# Altium project YAPCBBC.PrjPcb
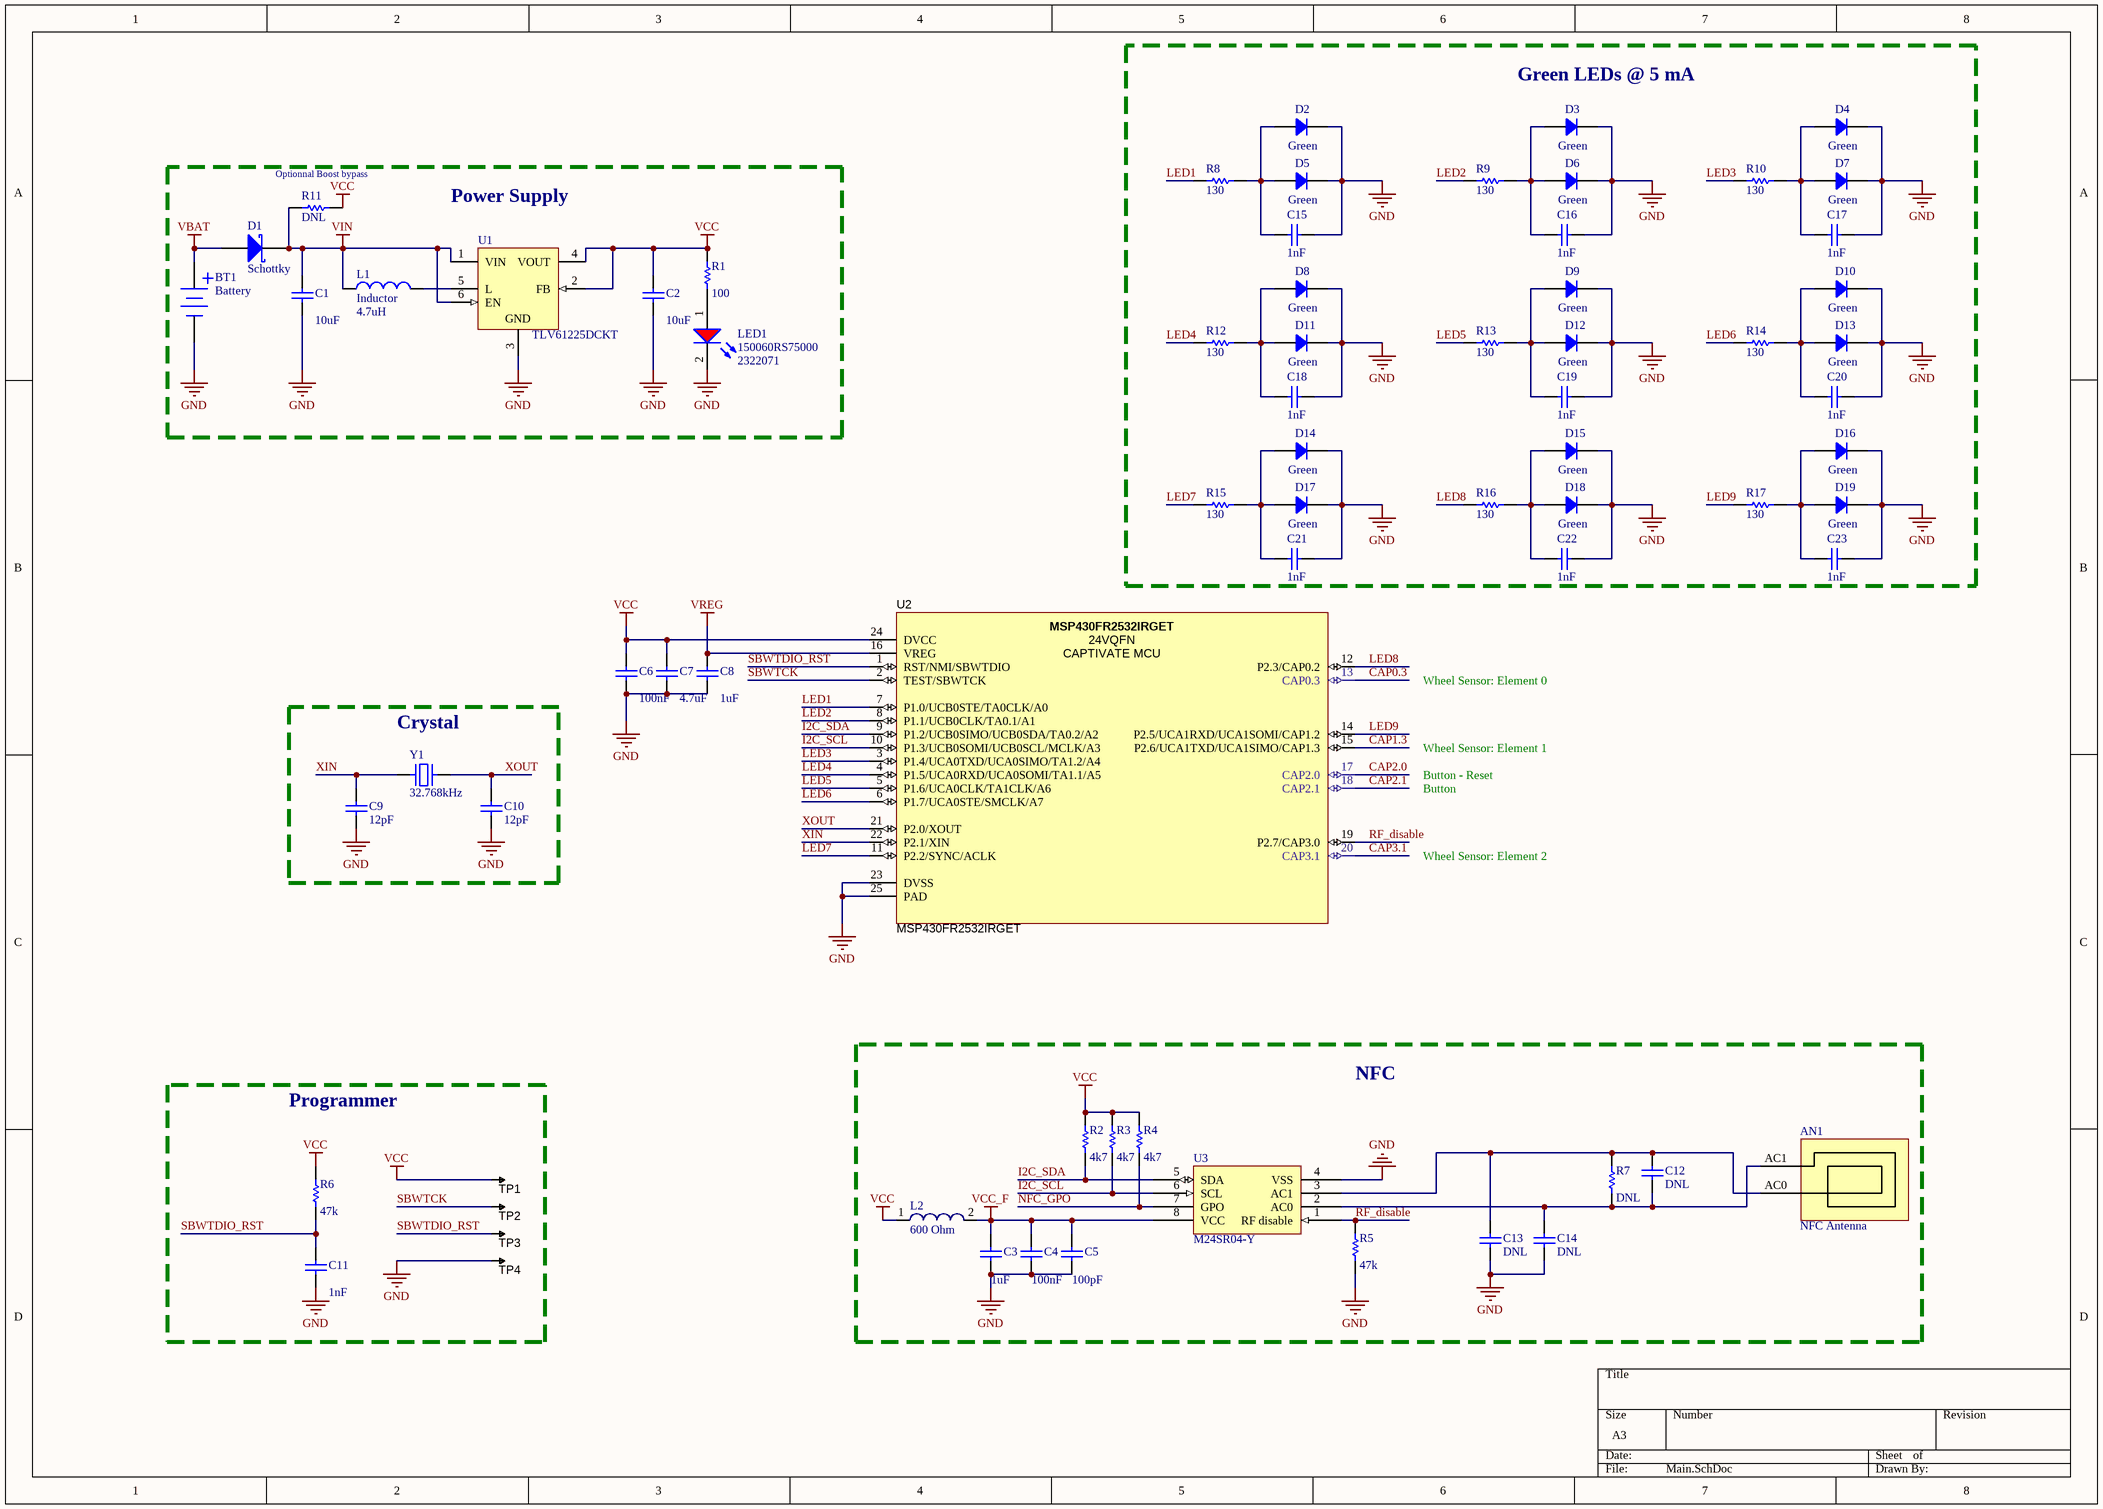
[diagram p0: Main.SchDoc]
1 sheet, 72 parts. Net scope: global (net labels, ports and power ports of the same name join across sheets).
Board file: YAPCBBC.PcbDoc

## Sheet Main.SchDoc
size A3

### Parts
AN1  NFC Antenna  [NFC_Antenna]
BT1  Battery  [BC-2001]
C1  value 10uF  [1608[0603]]  (hidden comment: Cap)
C2  value 10uF  [1608[0603]]  (hidden comment: Cap)
C3  value 1uF  [1608[0603]]  (hidden comment: Cap)
C4  value 100nF  [1608[0603]]  (hidden comment: Cap)
C5  value 100pF  [1608[0603]]  (hidden comment: Cap)
C6  value 100nF  [1608[0603]]  (hidden comment: Cap)
C7  value 4.7uF  [1608[0603]]  (hidden comment: Cap)
C8  value 1uF  [1608[0603]]  (hidden comment: Cap)
C9  value 12pF  [1608[0603]]  (hidden comment: Cap)
C10  value 12pF  [1608[0603]]  (hidden comment: Cap)
C11  value 1nF  [1608[0603]]  (hidden comment: Cap)
C12  value DNL  [1608[0603]]  (hidden comment: Cap)
C13  value DNL  [1608[0603]]  (hidden comment: Cap)
C14  value DNL  [1608[0603]]  (hidden comment: Cap)
C15  value 1nF  [1608[0603]]  (hidden comment: Cap)
C16  value 1nF  [1608[0603]]  (hidden comment: Cap)
C17  value 1nF  [1608[0603]]  (hidden comment: Cap)
C18  value 1nF  [1608[0603]]  (hidden comment: Cap)
C19  value 1nF  [1608[0603]]  (hidden comment: Cap)
C20  value 1nF  [1608[0603]]  (hidden comment: Cap)
C21  value 1nF  [1608[0603]]  (hidden comment: Cap)
C22  value 1nF  [1608[0603]]  (hidden comment: Cap)
C23  value 1nF  [1608[0603]]  (hidden comment: Cap)
D1  Schottky  [SOT23_N]
D2  Color: Green  [LED 0805/2012 GREEN]  (hidden comment: 1318243)
D3  Color: Green  [LED 0805/2012 GREEN]  (hidden comment: 1318243)
D4  Color: Green  [LED 0805/2012 GREEN]  (hidden comment: 1318243)
D5  Color: Green  [LED 0805/2012 GREEN]  (hidden comment: 1318243)
D6  Color: Green  [LED 0805/2012 GREEN]  (hidden comment: 1318243)
D7  Color: Green  [LED 0805/2012 GREEN]  (hidden comment: 1318243)
D8  Color: Green  [LED 0805/2012 GREEN]  (hidden comment: 1318243)
D9  Color: Green  [LED 0805/2012 GREEN]  (hidden comment: 1318243)
D10  Color: Green  [LED 0805/2012 GREEN]  (hidden comment: 1318243)
D11  Color: Green  [LED 0805/2012 GREEN]  (hidden comment: 1318243)
D12  Color: Green  [LED 0805/2012 GREEN]  (hidden comment: 1318243)
D13  Color: Green  [LED 0805/2012 GREEN]  (hidden comment: 1318243)
D14  Color: Green  [LED 0805/2012 GREEN]  (hidden comment: 1318243)
D15  Color: Green  [LED 0805/2012 GREEN]  (hidden comment: 1318243)
D16  Color: Green  [LED 0805/2012 GREEN]  (hidden comment: 1318243)
D17  Color: Green  [LED 0805/2012 GREEN]  (hidden comment: 1318243)
D18  Color: Green  [LED 0805/2012 GREEN]  (hidden comment: 1318243)
D19  Color: Green  [LED 0805/2012 GREEN]  (hidden comment: 1318243)
L1  Inductor  value 4.7uH  [VLS2010E]
L2  600 Ohm  [SMD 0805]
LED1  150060RS75000  Supplier Part Number 1: 2322071  [LED_0603_Red]
R1  value 100  [J1-0603]  (hidden comment: Res1)
R2  value 4k7  [J1-0603]  (hidden comment: Res1)
R3  value 4k7  [J1-0603]  (hidden comment: Res1)
R4  value 4k7  [J1-0603]  (hidden comment: Res1)
R5  value 47k  [J1-0603]  (hidden comment: Res1)
R6  value 47k  [J1-0603]  (hidden comment: Res1)
R7  value DNL  [J1-0603]  (hidden comment: Res1)
R8  value 130  [J1-0603]  (hidden comment: Res1)
R9  value 130  [J1-0603]  (hidden comment: Res1)
R10  value 130  [J1-0603]  (hidden comment: Res1)
R11  value DNL  [J1-0603]  (hidden comment: Res1)
R12  value 130  [J1-0603]  (hidden comment: Res1)
R13  value 130  [J1-0603]  (hidden comment: Res1)
R14  value 130  [J1-0603]  (hidden comment: Res1)
R15  value 130  [J1-0603]  (hidden comment: Res1)
R16  value 130  [J1-0603]  (hidden comment: Res1)
R17  value 130  [J1-0603]  (hidden comment: Res1)
TP1  TESTPOINT  [TP-R60]  (value not drawn)  (no BOM)
TP2  TESTPOINT  [TP-R60]  (value not drawn)  (no BOM)
TP3  TESTPOINT  [TP-R60]  (value not drawn)  (no BOM)
TP4  TESTPOINT  [TP-R60]  (value not drawn)  (no BOM)
U1  TLV61225DCKT  [DCK0006A_M]
U2  MSP430FR2532IRGET  [RGE24_N]
U3  M24SR04-Y  [ST TSSOP-8]
Y1  32.768kHz  [ABRACON ABS25]

### Blocks framed on the sheet
Green LEDs @ 5 mA: C15-C23 D2-D19 R8-R10 R12-R17
Power Supply: BT1 C1 C2 D1 L1 LED1 R1 R11 U1
Crystal: C9 C10 Y1
Programmer: C11 R6 TP1-TP4
NFC: AN1 C3-C5 C12-C14 L2 R2-R5 R7 U3

### Nets
GND: BT1.2(-) C1.1 C2.1 C3.1 C4.1 C5.1 C6.1 C7.1 C8.1 C9.1 C10.1 C11.1 C13.1 C14.1 C15.1 C16.1 C17.1 C18.1 C19.1 C20.1 C21.1 C22.1 C23.1 D2.2 D3.2 D4.2 D5.2 D6.2 D7.2 D8.2 D9.2 D10.2 D11.2 D12.2 D13.2 D14.2 D15.2 D16.2 D17.2 D18.2 D19.2 LED1.2(C) R5.1 TP4.1 U1.3(GND) U2.23(DVSS) U2.25(PAD) U3.4(VSS)
VBAT: BT1.1(+) D1.1(A)
VCC: C2.2 C6.2 C7.2 L2.1 R1.2 R2.2 R3.2 R4.2 R6.2 R11.1 TP1.1 U1.2(FB) U1.4(VOUT) U2.24(DVCC)
VCC_F: C3.2 C4.2 C5.2 L2.2 U3.8(VCC)
VIN: C1.2 D1.2(K) L1.1 R11.2 U1.1(VIN) U1.6(EN)
VREG: C8.2 U2.16(VREG)
CAP0.3: U2.13(CAP0.3)
CAP1.3: U2.15(P2.6/UCA1TXD/UCA1SIMO/CAP1.3)
CAP2.0: U2.17(CAP2.0)
CAP2.1: U2.18(CAP2.1)
CAP3.1: U2.20(CAP3.1)
I2C_SCL: R3.1 U2.10(P1.3/UCB0SOMI/UCB0SCL/MCLK/A3) U3.6(SCL)
I2C_SDA: R2.1 U2.9(P1.2/UCB0SIMO/UCB0SDA/TA0.2/A2) U3.5(SDA)
LED1: R8.2 U2.7(P1.0/UCB0STE/TA0CLK/A0)
LED2: R9.2 U2.8(P1.1/UCB0CLK/TA0.1/A1)
LED3: R10.2 U2.3(P1.4/UCA0TXD/UCA0SIMO/TA1.2/A4)
LED4: R12.2 U2.4(P1.5/UCA0RXD/UCA0SOMI/TA1.1/A5)
LED5: R13.2 U2.5(P1.6/UCA0CLK/TA1CLK/A6)
LED6: R14.2 U2.6(P1.7/UCA0STE/SMCLK/A7)
LED7: R15.2 U2.11(P2.2/SYNC/ACLK)
LED8: R16.2 U2.12(P2.3/CAP0.2)
LED9: R17.2 U2.14(P2.5/UCA1RXD/UCA1SOMI/CAP1.2)
NFC_GPO: R4.1 U3.7(GPO)
RF_disable: R5.2 U2.19(P2.7/CAP3.0) U3.1(RF_disable)
SBWTCK: TP2.1 U2.2(TEST/SBWTCK)
SBWTDIO_RST: C11.2 R6.1 TP3.1 U2.1(RST/NMI/SBWTDIO)
XIN: C9.2 U2.22(P2.1/XIN) Y1.1
XOUT: C10.2 U2.21(P2.0/XOUT) Y1.4
NetAN1_AC0: AN1.AC0 C12.2 C13.2 R7.2 U3.3(AC1)
NetAN1_AC1: AN1.AC1 C12.1 C14.2 R7.1 U3.2(AC0)
NetC15_2: C15.2 D2.1 D5.1 R8.1
NetC16_2: C16.2 D3.1 D6.1 R9.1
NetC17_2: C17.2 D4.1 D7.1 R10.1
NetC18_2: C18.2 D8.1 D11.1 R12.1
NetC19_2: C19.2 D9.1 D12.1 R13.1
NetC20_2: C20.2 D10.1 D13.1 R14.1
NetC21_2: C21.2 D14.1 D17.1 R15.1
NetC22_2: C22.2 D15.1 D18.1 R16.1
NetC23_2: C23.2 D16.1 D19.1 R17.1
NetL1_2: L1.2 U1.5(L)
NetLED1_1: LED1.1(A) R1.1

### Notes on the sheet
- (near R11) Optionnal Boost bypass
- Wheel Sensor: Element 0
- Wheel Sensor: Element 1
- Button
- Button - Reset
- Wheel Sensor: Element 2
- (in symbol MSP430FR2532IRGET) 24VQFN; CAPTIVATE MCU

### Library data of the parts
AN1 = NFC_Antenna: L=5.51 uH, tuned for 13.56 MHz; L: 5.51 uH
BT1 = Battery: Multicell Battery; pin to pad: 1>+ 2>-; PackageReference: BAT-2; PackageDescription: Battery; 2 Leads; Supplier 1: Farnell; Supplier Part Number 1: 2064713
C1-C23 = Cap: Capacitor
  C1 C2: Supplier 1: Farnell; Supplier Part Number 1: 1735528
  C3 C8: Supplier 1: Farnell; Supplier Part Number 1: 1759399
  C4 C6: Supplier 1: Farnell; Supplier Part Number 1: 1759038
  C5: Supplier 1: Farnell; Supplier Part Number 1: 722110
  C7: Supplier 1: Farnell; Supplier Part Number 1: 2320818
  C9 C10: Supplier 1: Farnell; Supplier Part Number 1: 1759054
  C11 C15-C23: Supplier 1: Farnell; Supplier Part Number 1: 1759088
D1 = D Schottky: Schottky Diode; Supplier 1: Farnell; Supplier Part Number 1: 9801383
D2-D19 = Diode: Rectifier Diode; Supplier 1: Farnell; Supplier Part Number 1: 1318243
L2 = WE-CBF 0805, 742792042: SMD EMI Suppression Ferrite Beads WE-CBF, Z= 600 Ohm; Manufacturer: Würth Elektronik eiSos GmbH; Impedance: 600 Ohm; ComponentLink1Description: Manufacturer; ComponentLink1URL: http://www.we-online.de; Created by: Christin Zierenner; Created Date: May 2009; partNo: 742792042; ComponentLink2Description: Datasheet; ComponentLink2URL: http://www.we-online.de/katalog/media/pdf/742792042.pdf; Supplier 1: Farnell; Supplier Part Number 1: 1635716
LED1 = WL-SMCW 0603  150060RS75000: SMD mono-color Chip LED, WL-SMCW, Red; Manufacturer: W黵th Elektronik eiSos GmbH; PartNo: 150060RS75000; ComponentLink1Description: Manufacturer; ComponentLink1URL: http://www.we-online.de; Created by: Christin Otto; Created Date: June 2013; ComponentLink2Description: Datasheet; ComponentLink2URL: http://katalog.we-online.com/led/datasheet/150060RS75000.pdf; Color: Red; Supplier 1: Farnell
R1-R17 = Res1: Resistor
  R1: Supplier 1: Farnell; Supplier Part Number 1: 2008332
  R2-R4: Supplier 1: Farnell; Supplier Part Number 1: 9331247
  R5 R6: Supplier 1: Farnell; Supplier Part Number 1: 9331255
  R8-R10 R12-R17: Supplier 1: Farnell; Supplier Part Number 1: 9330542
TP1-TP4 = TESTPOINT: SMD test pin
U1 = CMP-0343-00078-2: Voltage Converter with 0.7 to 3.3 V Input, -40 to 85 degC, 6-Pin SC70 (DCK), Green (RoHS & no Sb/Br); Manufacturer: Texas Instruments; SubFamily: Step-Up Regulator; Vin(Min)(V): 0.7; Regulated Outputs(#): 1; Vin(Max)(V): 3.3; Switching Frequency(Max)(kHz): 2000; ComponentLink2URL: http://www.ti.com/litv/pdf/mpds114c; PartNumber: TLV61225DCKT; ComponentLink1URL: http://www.ti.com/general/docs/lit/getliterature.tsp?genericPartNumber=TLV61225&fileType=pdf; ComponentLink1Description: Datasheet; PackageReference: DCK0006A; Eco-Plan: Green (RoHS & no Sb/Br); ComponentLink2Description: Package Specification; Vout(Max)(V): 3.3; PackageVersion: revG, Jan-2007; Mounting Technology: Surface Mount; DatasheetVersion: SLVSAF0; Code_JEDEC: MO-203-AB; PackageDescription: 6-Pin Plastic Small-Outline Package, 2 x 1.3 mm Body, 0.65 mm Pitch, 2.1 mm Lead Span; Supplier 1: Farnell; Supplier Part Number 1: 2492362
U2 = MSP430FR2532IRGET: MSP430 Captivate Microcontroller; Manufacturer: Texas Instruments; SymbolCreator: B.B.; CompType: IC; U/M: EA, IN, or GM; SymbolVersion: 13-09-2016; MountType: SMT; PartNumber: MSP430FR2532IRGET; PackageReference: RGE (24VQFN); ComponentLink1Description: Datasheet Link; Alternate PartNumber: -; Alternate Manufacturer: -; Supplier 1: Farnell; Supplier Part Number 1: 2529114
U3 = M24SR04-Y: Dynamic NFC/RFID tag IC with 4-Kbit EEPROM,   NFC Forum Type 4 Tag and I²C interface; Supplier 1: Farnell; Supplier Part Number 1: 2396463
Y1 = Abracon Crystal ABS25: SMT Crystal; Value: 32.768kHz; Supplier 1: Farnell; Supplier Part Number 1: 1611824
L1 = Inductor: PackageDescription: Chip Inductor; Supplier 1: Farnell; Supplier Part Number 1: 2455335